# EAGLE design RAK4600_WCharging (EAGLE 9.6.2)
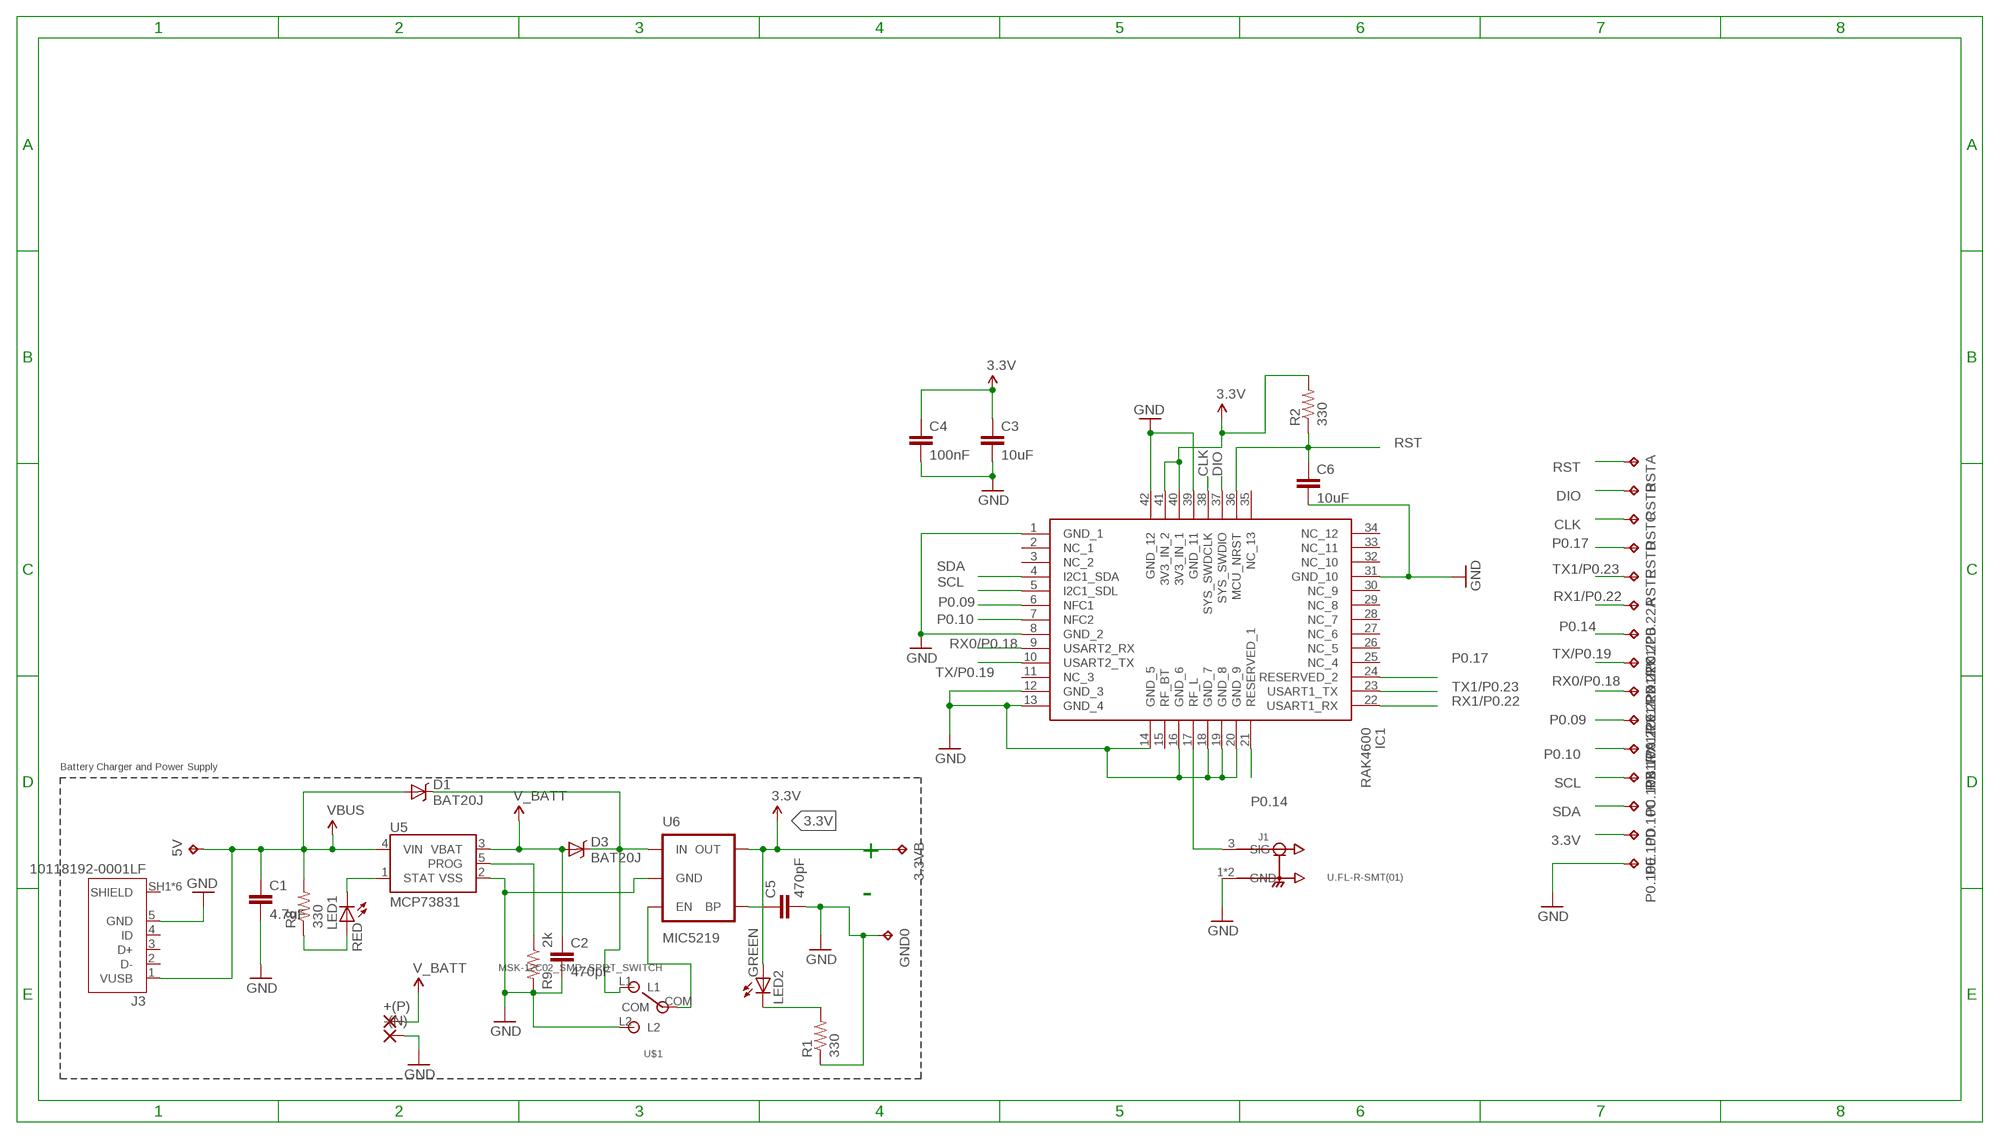
[diagram p0: schematic, sheet 1]

## Parts
3.3VB  TPTP12SQ  [TP12SQ]
5V  TPTP12SQ  [TP12SQ]
+(P)  SMD2  [SMD1,27-2,54]
-(N)  SMD2  [SMD1,27-2,54]
C1  4.7uF  CAP0402-CAP  [0402-CAP]
C2  470pF  CAP0402-CAP  [0402-CAP]
C3  10uF  CAP0402-CAP  [0402-CAP]
C4  100nF  CAP0402-CAP  [0402-CAP]
C5  470pF  CAP0402-CAP  [0402-CAP]
C6  10uF  CAP0402-CAP  [0402-CAP]
D1  BAT20J  DIODE-SCHOTTKY-BAT20J  [SOD-323]
D3  BAT20J  DIODE-SCHOTTKY-BAT20J  [SOD-323]
GND0  TPTP12SQ  [TP12SQ]
IC1  RAK4600  [RAK4600]
J1  U.FL-R-SMT(01)  [HRS_U.FL-R-SMT(01)]
J3  10118192-0001LF  [AMPHENOL_10118192-0001LF]
LED1  RED  LED0603  [LED-0603]
LED2  GREEN  LED0603  [LED-0603]
P0.10  TP5P5-25-13  [P5-25-13]
R1  330  RESISTOR0402-RES  [0402-RES]
R2  330  RESISTOR0402-RES  [0402-RES]
R8  330  RESISTOR0402-RES  [0402-RES]
R9  2k  RESISTOR0603-RES  [0603-RES]
RST  TP5P5-25-13  [P5-25-13]
RX1/P0.22  TP5P5-25-13  [P5-25-13]
U5  MCP73831  [SOT23-5]
U6  MIC5219  V_REG_MIC52193.3V  [SOT23-5]
U$1  MSK-12C02_SMD_SPDT_SWITCH  [MSK-12C02]

## Nets
3.3V: 3.3VB.TP C3.1 C4.1 IC1.40(3V3_IN_1) IC1.41(3V3_IN_2) LED2.A P0.10.TP-4 R2.2 U6.5(OUT)
5V: 5V.TP C1.1 D1.A J3.1(VUSB) R8.2 U5.4(VIN) ; supply symbol labelled VBUS
CLK: IC1.38(SYS_SWDCLK) RST.TP-3
DIO: IC1.37(SYS_SWDIO) RST.TP-2
GND: -(N).1(P) C1.2 C2.2 C3.2 C4.2 C5.2 C6.2 GND0.TP IC1.1(GND_1) IC1.8(GND_2) IC1.12(GND_3) IC1.13(GND_4) IC1.14(GND_5) IC1.16(GND_6) IC1.18(GND_7) IC1.19(GND_8) IC1.20(GND_9) IC1.31(GND_10) IC1.39(GND_11) IC1.42(GND_12) J1.1(GND) J1.2(GND) J3.5(GND) P0.10.TP-5 R1.1 R9.2 U5.2(VSS) U6.2(GND) U$1.L2
N$1: LED2.C R1.2
N$2: D1.C D3.C U6.1(IN) U$1.L1
N$3: IC1.17(RF_L) J1.3(SIG)
N$4: R9.1 U5.5(PROG)
N$5: U6.3(EN) U$1.COM
N$12: LED1.A R8.1
N$13: LED1.C U5.1(STAT)
N$15: C5.1 U6.4(BP)
P0.09: IC1.6(NFC1) RX1/P0.22.TP-5
P0.10: IC1.7(NFC2) P0.10.TP-1
P0.14: IC1.21(RESERVED_1) RX1/P0.22.TP-2
P0.17: IC1.24(RESERVED_2) RST.TP-4
RST: C6.1 IC1.36(MCU_NRST) R2.1 RST.TP-1
RX0/P0.18: IC1.9(USART2_RX) RX1/P0.22.TP-4
RX1/P0.22: IC1.22(USART1_RX) RX1/P0.22.TP-1
SCL: IC1.5(I2C1_SDL) P0.10.TP-2
SDA: IC1.4(I2C1_SDA) P0.10.TP-3
TX1/P0.23: IC1.23(USART1_TX) RST.TP-5
TX/P0.19: IC1.10(USART2_TX) RX1/P0.22.TP-3
V_BATT: +(P).1(P) C2.1 D3.A U5.3(VBAT)
Unconnected: IC1.2(NC_1) IC1.3(NC_2) IC1.11(NC_3) IC1.15(RF_BT) IC1.25(NC_4) IC1.26(NC_5) IC1.27(NC_6) IC1.28(NC_7) IC1.29(NC_8) IC1.30(NC_9) IC1.32(NC_10) IC1.33(NC_11) IC1.34(NC_12) IC1.35(NC_13) J3.2(D-) J3.3(D+) J3.4(ID) J3.SH1(SHIELD) J3.SH2(SHIELD) J3.SH3(SHIELD) J3.SH4(SHIELD) J3.SH5(SHIELD) J3.SH6(SHIELD)

## Notes on the sheet
- Battery Charger and Power Supply
- +
- -

## Library data of the parts
3.3VB 5V GND0 = testpad:TP: Test pad; SPICEPREFIX: X
+(P) -(N) = wirepad:SMD2: SMD PAD
C1-C6 = SparkFun-Passives:CAP: Capacitor Standard 0603 ceramic capacitor, and 0.1" leaded capacitor.; PROD_ID: CAP-07884
D1 D3 = SparkFun-DiscreteSemi:DIODE-SCHOTTKY: Schottky diodes in SFE's production catalog BAT20J 1A 23V 0.62Vf RB751 120mA 40V 0.37Vf PMEG4005EJ 0.5A 40V 0.42Vf MBRA140 1A 40V 0.5Vf B340A 3A 40V SMA; PROD_ID: DIO-11623
IC1 = SamacSys_Parts:RAK4600: LoRa Module Source: Datasheet <https://doc.rakwireless.com/datasheet/rakproducts/rak4600-lora-module-datasheet>; ARROW_PART_NUMBER: RAK4600; DESCRIPTION: LoRa Module; HEIGHT: 2.5mm; MANUFACTURER_NAME: RAK; MANUFACTURER_PART_NUMBER: RAK4600
J1 = U.FL-R-SMT_01_:U.FL-R-SMT(01): U.FL Series 6 Ghz 50 Ohm Ultra-small SMT Coaxial Cable Receptacle Check prices <https://pricing.snapeda.com/search/part/U.FL-R-SMT%2801%29/?ref=eda>; AVAILABILITY: Warning; DESCRIPTION: U.FL (UMCC) Connector Receptacle, Male Pin 50Ohm Surface Mount Solder; MF: Hirose; MP: U.FL-R-SMT(01); PACKAGE: None; PRICE: None; PURCHASE-URL: https://pricing.snapeda.com/search/part/U.FL-R-SMT(01)/?ref=eda
J3 = 10118192-0001LF:10118192-0001LF: Single Port 5 Contact Horizontal Right Angle Shielded Micro B USB 2.0 Connector; AVAILABILITY: Unavailable; DESCRIPTION: USB - micro B USB 2.0 Receptacle Connector 5 Position Surface Mount, Right Angle; MF: Amphenol ICC; MP: 10118192-0001LF; PACKAGE: None; PRICE: None
LED1 LED2 = SparkFun-LED:LED: LEDs Standard schematic elements and footprints for 5mm, 3mm, 1206, and 0603 sized LEDs. 5mm - Spark Fun Electronics SKU : COM-00529 (and others); PROD_ID: DIO-00819
P0.10 RST RX1/P0.22 = testpad:TP5: Test pad
R1 R2 R8 = SparkFun-Passives:RESISTOR: Resistor Basic schematic elements and footprints for 0603, 1206, and PTH resistors.; PROD_ID: RES-00818
R9 = SparkFun-Resistors:RESISTOR: Resistor Basic schematic elements and footprints for 0603, 1206, and PTH resistors.; PROD_ID: RES-00824
U5 = SparkFun-PowerIC:MCP73831: Miniature single cell, fully integrated Li-Ion, Li-polymer charge management controller http://ww1.microchip.com/downloads/en/DeviceDoc/21984a.pdf IC-09995; PROD_ID: IC-09995
U6 = SparkFun-PowerIC:V_REG_MIC5219: V_REG MIC5219 Standard 3.3V and 5V 500mA LDO voltage regulator in SOT-23 layout. Micrel part MIC5219. BP (by-pass) pin is used to lower output noise with 470pF cap, may be left open.; PROD_ID: VREG-09872; VALUE: MIC5219 3.3V
U$1 = MSK-12C02 SMD Micro Slider Switch SPDT:MSK-12C02_SMD_SPDT_SWITCH: Footprint of the VIMEX MSK-12C02 SPDT SMD Switch Created by mzst on 17-Jan-2016

## Board
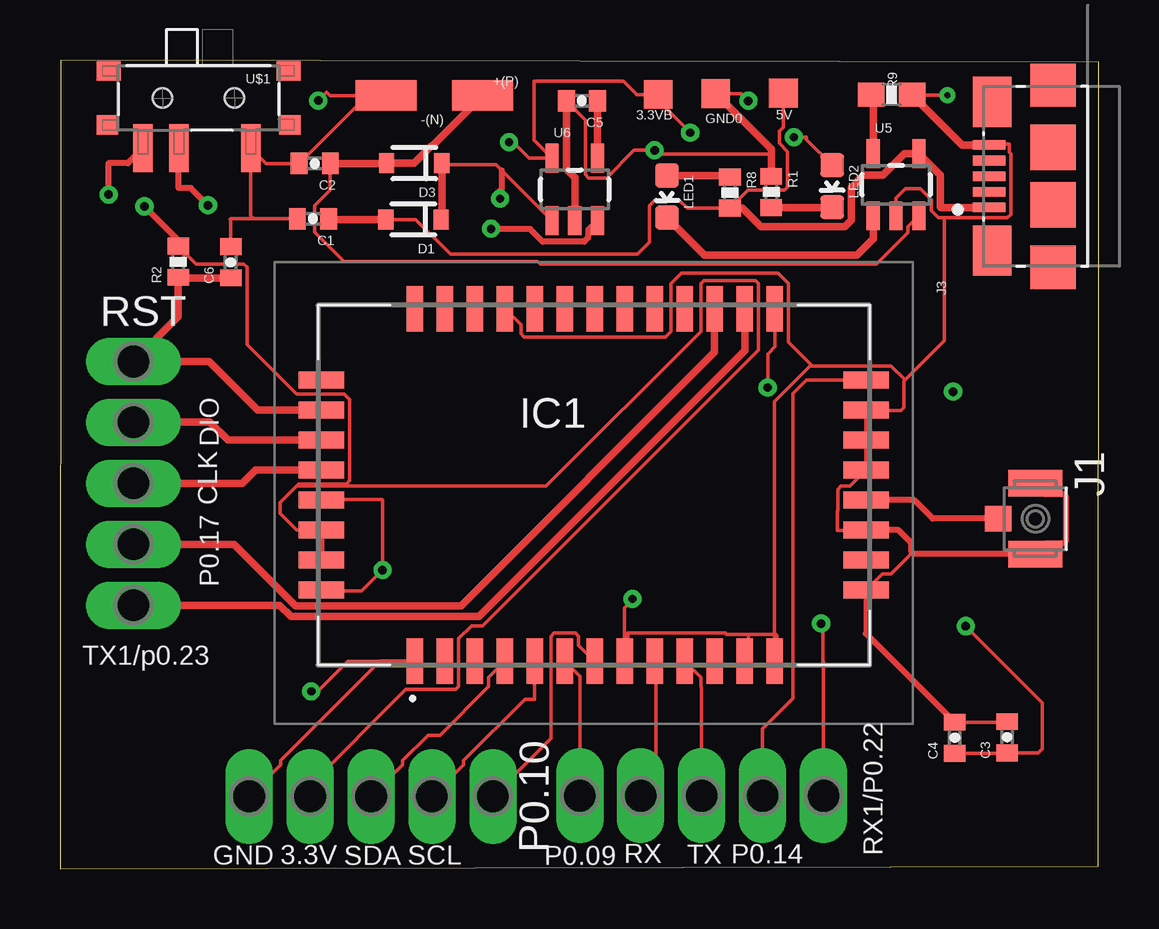
[diagram p1: board, top side]
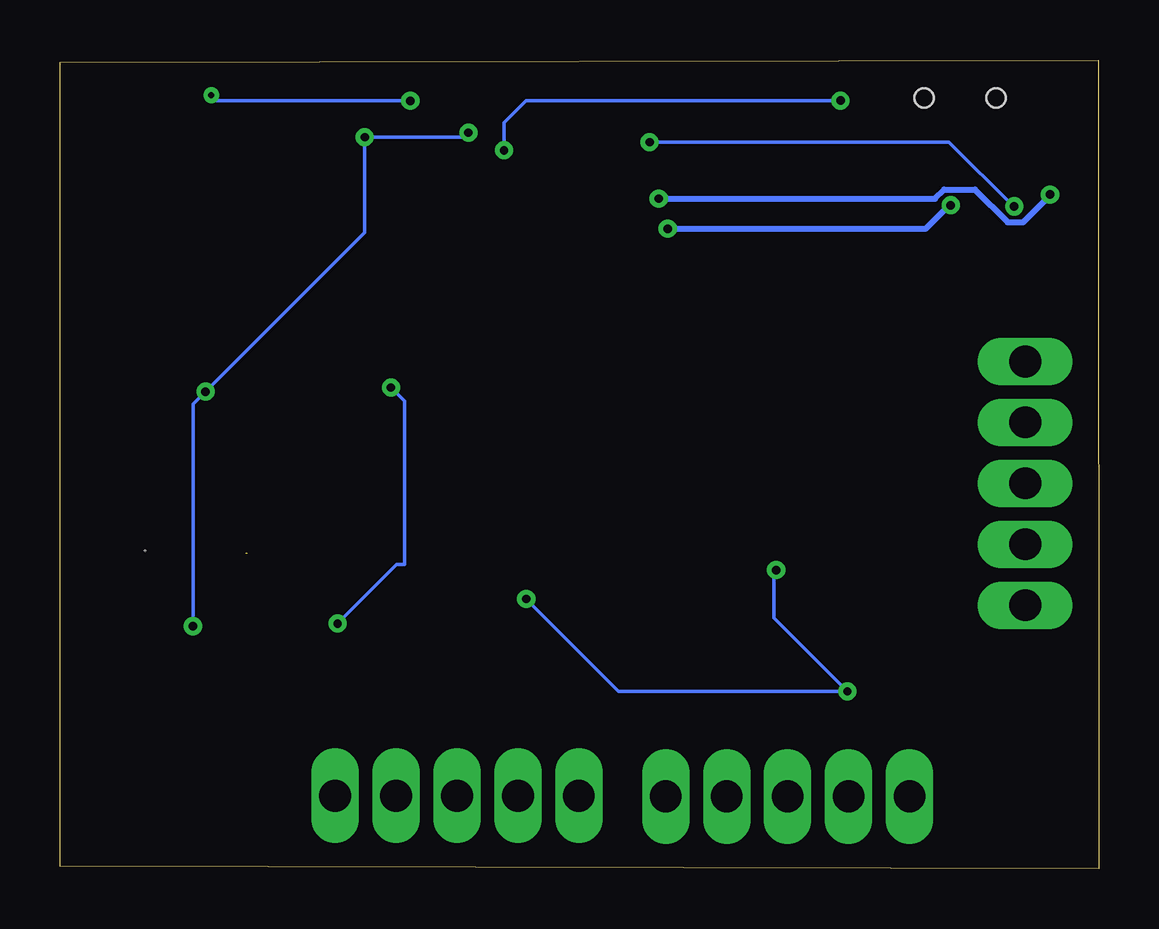
[diagram p2: board, bottom side, seen from below]

Size 43.3 x 33.71 mm. Coordinates in mm from the lower left corner, seen from the top.
Outline: 0,0 43.28,0.1 43.3,33.62 0.02,33.71 0,0
Copper layers (1*16): Top 0.035mm / dielectric 1.5mm / Bottom 0.035mm
Design rules "default": minimum track width 6mil, minimum drill 0.35mm, track to track 6mil, track to pad 6mil, pad to pad 6mil, via to via 6mil, smd to smd 6mil, copper to edge 40mil, drill to drill 6mil, minimum pad ring 10mil, minimum via ring 8mil, stop-mask expansion 4mil, vias tented up to drill 0mil, thermal gap 10mil

### Footprints (pad centres in the part's own frame; a part is rotated, then mirrored left to right if it is on the bottom)
TP12SQ = smd 1.2 x 1.2: TP 0,0
SMD1,27-2,54 = smd 1.27 x 2.54: 1 0,0
0402-CAP = smd 0.7 x 0.9: 1 -0.65,0; 2 0.65,0
SOD-323 = smd 0.63 x 0.83: A 1.15,0; C -1.15,0
RAK4600 = smd 0.7 x 1.9: 1 -7.5,-7.35; 2 -6.25,-7.35; 3 -5,-7.35; 4 -3.75,-7.35; 5 -2.5,-7.35; 6 -1.25,-7.35; 7 0,-7.35; 8 1.25,-7.35; 9 2.5,-7.35; 10 3.75,-7.35; 11 5,-7.35; 12 6.25,-7.35; 13 7.5,-7.35; 22 7.5,7.35; 23 6.25,7.35; 24 5,7.35; 25 3.75,7.35; 26 2.5,7.35; 27 1.25,7.35; 28 0,7.35; 29 -1.25,7.35; 30 -2.5,7.35; 31 -3.75,7.35; 32 -5,7.35; 33 -6.25,7.35; 34 -7.5,7.35 | smd 1.9 x 0.7: 14 11.309,-4.375; 15 11.309,-3.125; 16 11.309,-1.875; 17 11.309,-0.625; 18 11.309,0.625; 19 11.309,1.875; 20 11.309,3.125; 21 11.309,4.375; 35 -11.391,4.375; 36 -11.391,3.125; 37 -11.391,1.875; 38 -11.391,0.625; 39 -11.391,-0.625; 40 -11.391,-1.875; 41 -11.391,-3.125; 42 -11.391,-4.375
HRS_U.FL-R-SMT(01) = smd 1.1 x 2.25: 1 -1.475,0; 2 1.475,0 | smd 1.05 x 1.1: 3 0,-1.55
AMPHENOL_10118192-0001LF = smd 0.4 x 1.35: 1 -1.3,0; 2 -0.65,0; 3 0,0; 4 0.65,0; 5 1.3,0 | smd 2.1 x 1.6: SH1 -3.1,-0.125; SH2 3.1,-0.125 | smd 1.8 x 1.9: SH3 -3.8,-2.675; SH6 3.8,-2.675 | smd 1.9 x 1.9: SH4 -1.2,-2.675; SH5 1.2,-2.675
LED-0603 = smd 1 x 1: A 0,-0.877; C 0,0.877
P5-25-13 = drill 1.321 pad 1.905 long: TP-1 -5.08,0; TP-2 -2.54,0; TP-3 0,0; TP-4 2.54,0; TP-5 5.08,0
0402-RES = smd 0.7 x 0.9: 1 -0.65,0; 2 0.65,0
0603-RES = smd 1.1 x 1: 1 -0.85,0; 2 0.85,0
SOT23-5 = smd 0.55 x 1.2: 1 -0.95,-1.3; 2 0,-1.3; 3 0.95,-1.3; 4 0.95,1.3; 5 -0.95,1.3
MSK-12C02 = smd 0.8 x 2: COM 0.823,2.1; L1 2.323,2.1; L2 -2.177,2.1 | smd 1 x 0.8: GND@1 -3.75,-1.125; GND@4 3.75,-1.125 | smd 0.9 x 0.8: GND@2 -3.8,1.125; GND@3 3.8,1.125 | hole 0.8: -1.5,0; 1.5,0

### Placement (x,y rotation side)
3.3VB  24.93,32.28 180 top
5V  30.16,32.32 0 top
+(P)  17.61,32.22 270 top
-(N)  13.6,32.23 90 top
C1  10.55,27.09 180 top
C2  10.62,29.4 180 top
C3  39.48,5.48 90 top
C4  37.29,5.46 90 top
C5  21.76,32.01 180 top
C6  7.12,25.28 90 top
D1  14.73,27.06 180 top
D3  14.77,29.41 180 top
GND0  27.33,32.3 0 top
IC1  22.29,15.99 0 top
J1  40.65,14.59 270 top
J3  38.73,28.86 90 top
LED1  25.31,28.02 180 top
LED2  32.19,28.45 180 top
P0.10  12.97,3.01 180 top
R1  29.65,28.21 270 top
R2  4.93,25.3 90 top
R8  27.93,28.18 270 top
R9  34.67,32.26 0 top
RST  3.06,16.06 270 top
RX1/P0.22  26.75,3.04 180 top
U5  34.85,28.51 0 top
U6  21.46,28.32 0 top
U$1  5.78,32.13 180 top

### Tracks (layer width: path | path; a pad name or v marks a point on that pad's centre or on a via)
3.3V  (via drill 0.35)
  Top 0.152: 3.3VB.TP 24.02,32.27 24.02,32.28 23.48,32.83 19.76,32.83 19.76,30.37 U6.5 19.54,29.62 18.88,30.29 v18.72,30.29 | 3.3VB.TP | LED2.A 31.12,30.39 31.12,30.49 v30.59,30.49 | v26.27,30.68 24.93,32.03 3.3VB.TP | R2.2 5.67,25.21 7.66,25.21 7.8,25.07 7.8,21.85 9.86,19.79 11.85,19.79 12.08,19.56 12.08,16.17 11.95,16.04 9.95,16.04 9.86,15.95 | P0.10.TP-4 10.43,3.48 14.41,7.46 16.49,7.46 16.62,7.6 16.62,9.59 17.15,10.12 17.62,10.12 29.12,21.62 29.12,24.39 28.99,24.52 26.85,24.52 26.71,24.39 26.71,22.39 20.27,15.95 10,15.95 9.86,15.95 | v37.23,19.89 37.27,19.85 | v37.76,10.11 40.95,6.92 40.95,5 40.77,4.83 C3.1 | C3.1 | C4.1 39.46,4.81 C3.1 | IC1.40 9.86,14.12 9.17,14.81 9.17,15.26 9.86,15.95
  Top 0.254: v3.52,27.61 4.93,26.2 R2.2 | IC1.41 IC1.40
  Bottom 0.152: v18.72,30.29 6.24,30.29 3.54,27.59 v3.52,27.61 | v26.27,30.68 26.27,30.66 26.44,30.49 v30.59,30.49 30.59,26.53 v37.23,19.89 37.76,19.36 v37.76,10.11
5V
  Top 0.152: D1.A 14.83,27.06 16.27,25.62 24.07,25.62 24.58,26.13 24.58,27.65 24.8,27.87 25.81,27.87 26.15,27.53 R8.2 28.68,28.28 30.2,28.28 30.33,28.42 30.33,29.9 29.99,30.24 29.99,30.75 30.16,30.92 5V.TP
  Top 0.305: U5.4 | U5.4 36.71,28.9 36.71,27.58 36.73,27.56 J3.1 | U5.4 35.2,29.81 34.3,28.91 33.5,28.91 32.99,28.4 32.99,27.04 32.73,26.77 29.21,26.77 28.45,27.53 R8.2 | D1.A 11.23,27.06 C1.1
CLK
  Top 0.305: IC1.38 8.15,16.62 7.59,16.06 RST.TP-3
DIO
  Top 0.305: IC1.37 7.01,17.87 6.25,18.63 3.09,18.63 RST.TP-2
GND  (via drill 0.25, 0.35)  (1 unrouted)
  Top 0.152: C6.2 7.12,27.05 7.1,27.07 7.12,27.09 8.09,27.09 | 8.09,27.09 C1.2 | 8.09,27.09 7.96,27.22 U$1.L2 8.59,29.4 C2.2 12.8,32.23 -(N).1 11.25,32.23 11.11,32.37 v10.76,32.02 | 27.14,32.3 GND0.TP 28.41,32.3 28.69,32.02 v28.69,32.01 | C5.2 21.91,31.21 21.91,28.92 22.04,28.79 22.78,28.79 23.94,29.95 v24.79,29.95 24.95,29.78 29.65,29.78 | U5.2 34.85,27.95 35.24,28.34 35.86,28.34 36.33,27.88 36.33,27.43 36.62,27.14 36.87,27.14 | 36.87,27.14 39.5,27.14 39.63,27.27 39.63,29.81 39.58,29.86 39.58,30.2 38.77,30.2 J3.5 | v36.99,32.24 35.54,32.24 R9.2 | 28.69,9.77 27.79,9.77 27.74,9.82 23.68,9.82 23.69,9.83 23.69,8.79 IC1.8 23.54,10.87 23.89,11.22 v23.86,11.24 | IC1.12 28.69,8.79 28.69,9.77 | 28.69,9.77 29.84,9.77 29.88,9.73 29.88,8.73 IC1.13 29.79,19.47 31.27,20.95 31.37,20.95 | 33.6,19.1 IC1.19 IC1.18 32.93,15.95 32.56,15.95 32.42,15.81 32.42,14.92 32.41,14.91 32.41,14.1 33.59,14.1 IC1.16 | 33.6,19.1 IC1.20 | 31.37,20.95 34.65,20.95 35.21,20.38 35.24,20.38 | 35.24,20.38 36.87,22.02 36.87,27.14 | 35.24,20.38 35.18,20.32 35.18,19.21 35.06,19.1 33.6,19.1 | 10.6,7.26 11.99,8.64 IC1.1 14.8,8.65 13.35,8.65 9.21,4.51 9.21,4.33 P0.10.TP-5 | 10.6,7.26 | 10.6,7.26 v10.48,7.39 | IC1.42 10.94,11.58 12.57,11.58 v13.44,12.45 13.44,15.36 13.42,15.38 10.92,15.38 IC1.39 | IC1.31 19.21,22.67 19.21,22.3 19.35,22.16 25.24,22.16 25.46,22.39 25.46,24.39 25.9,24.83 29.93,24.83 30.37,24.39 30.37,21.95 31.37,20.95 | C3.2 39.45,6.11 C4.2 37.45,6.26 | 35.49,13.13 35.49,13.23 | IC1.14 | 33.59,9.8 33.6,9.81 | 33.57,9.8 33.57,11.59 IC1.14 | IC1.14 34.27,12.29 34.65,12.29 35.49,13.14 35.65,13.14
  Top 0.254: 35.56,13.14 35.65,13.14 40.63,13.14 J1.2 41.1,13.56 41.85,13.56 41.93,13.64 41.93,15.54 41.85,15.62 41.09,15.62 J1.1 | 35.49,13.23 35.49,13.58 34.95,14.12 IC1.16 | C4.2 33.59,9.8 33.57,9.8
  Top 0.305: J3.5 37.61,30.16 R9.2 | GND0.TP 29.65,29.98 29.65,29.78 R1.1 | C5.2 21.11,29.16 21.46,28.81 U6.2 | IC1.31
  Bottom 0.152: v10.76,32.02 23.87,32.02 24.79,31.1 v24.79,29.95 | v36.99,32.24 36.76,32.01 v28.69,32.01 | v13.44,12.45 13.54,12.35 13.54,10.45 v10.48,7.39 20.01,7.39 v23.86,11.24
N$1
  Top 0.305: R1.2 32.18,27.56 LED2.C
N$2  (via drill 0.35)
  Top 0.152: U6.1 18.42,29.11 18.18,29.35 15.92,29.35
  Top 0.254: 18.42,29.11 18.42,28.33 18.31,28.22 18.31,27.96 v18.34,27.93 | U$1.L1 2.83,29.4 2.01,29.4 2.01,28.12 v2.03,28.1
  Top 0.305: D3.C 15.92,29.35 15.92,27.1 D1.C
  Bottom 0.254: v18.34,27.93 6.82,27.93 6.44,28.31 5.16,28.31 3.79,26.95 3.15,26.95 2.03,28.07 v2.03,28.1
N$3
  Top 0.254: J1.3 36.38,14.59 35.61,15.37 IC1.17
N$4
  Top 0.305: R9.1 33.9,32.18 U5.5
N$5  (via drill 0.35)
  Top 0.254: U6.3 22.01,26.62 22.01,26.3 21.85,26.14 20.12,26.14 19.6,26.66 17.97,26.66 v17.97,26.68 | v6.17,27.66 5.45,28.37 4.95,28.37 U$1.COM
  Bottom 0.254: v17.97,26.68 7.21,26.68 6.23,27.66 v6.17,27.66
N$12
  Top 0.305: LED1.A 27.86,28.9 R8.1
N$13
  Top 0.305: LED1.C 26.87,25.58 33.22,25.58 33.9,26.26 U5.1
N$15
  Top 0.305: U6.4 C5.1
P0.09
  Top 0.152: IC1.6 21.67,8.02 RX1/P0.22.TP-5
P0.10
  Top 0.152: P0.10.TP-1 20.46,5.43 20.46,9.69 20.6,9.82 21.49,9.82 21.62,9.69 21.62,9.31 IC1.7
P0.14
  Top 0.152: IC1.21 31.12,20.37 30.56,19.81 30.56,7.1 29.29,5.83 RX1/P0.22.TP-2
P0.17
  Top 0.305: RST.TP-4 7.26,13.52 9.82,10.96 16.72,10.96 27.29,21.53 IC1.24
RST
  Top 0.305: IC1.36 8.23,19.12 6.21,21.14 RST.TP-1 4.93,23.01 R2.1 4.95,24.63 C6.1
RX0/P0.18
  Top 0.152: IC1.9 24.83,8.6 24.83,3.67 RX1/P0.22.TP-4
RX1/P0.22  (via drill 0.35)
  Top 0.152: RX1/P0.22.TP-1 31.83,8.62 31.8,8.59 31.8,10.15 v31.73,10.22 | v29.5,20.06 29.5,21.45 29.81,21.76 29.81,23.32 IC1.22
  Bottom 0.152: v31.73,10.22 29.26,12.68 28.94,12.68 28.94,19.49 v29.5,20.06
SCL
  Top 0.152: P0.10.TP-2 16.83,4.33 16.83,4.51 19.38,7.06 19.78,7.06 19.79,7.07 IC1.5
SDA
  Top 0.152: IC1.4 17.87,7.97 17.87,7.6 15.84,5.56 15.34,5.56 14.29,4.51 14.29,4.33 P0.10.TP-3
TX1/P0.23
  Top 0.305: RST.TP-5 9.16,10.98 9.63,10.51 17.47,10.51 28.56,21.6 28.56,23.33 IC1.23
TX/P0.19
  Top 0.152: IC1.10 26.71,7.97 26.71,7.6 26.75,7.56 RX1/P0.22.TP-3
V_BATT
  Top 0.152: U5.3 35.35,26.76 35.35,26.52 34.03,25.2 20.02,25.2 19.9,25.32 16.94,25.32 16.72,25.32 11.85,25.32 10.62,26.54 10.62,27.63 11.27,28.28 C2.1
  Top 0.305: +(P).1 15.51,30.13 15.48,30.13 14.76,29.41 D3.A 13.61,29.4 C2.1

### Text on the board
tPlace: DIO | CLK | P0.17 | TX1/p0.23 | GND | 3.3V | SDA | SCL | P0.09 | RX | TX | P0.14